# Altium project PCB_Project1.PrjPCB
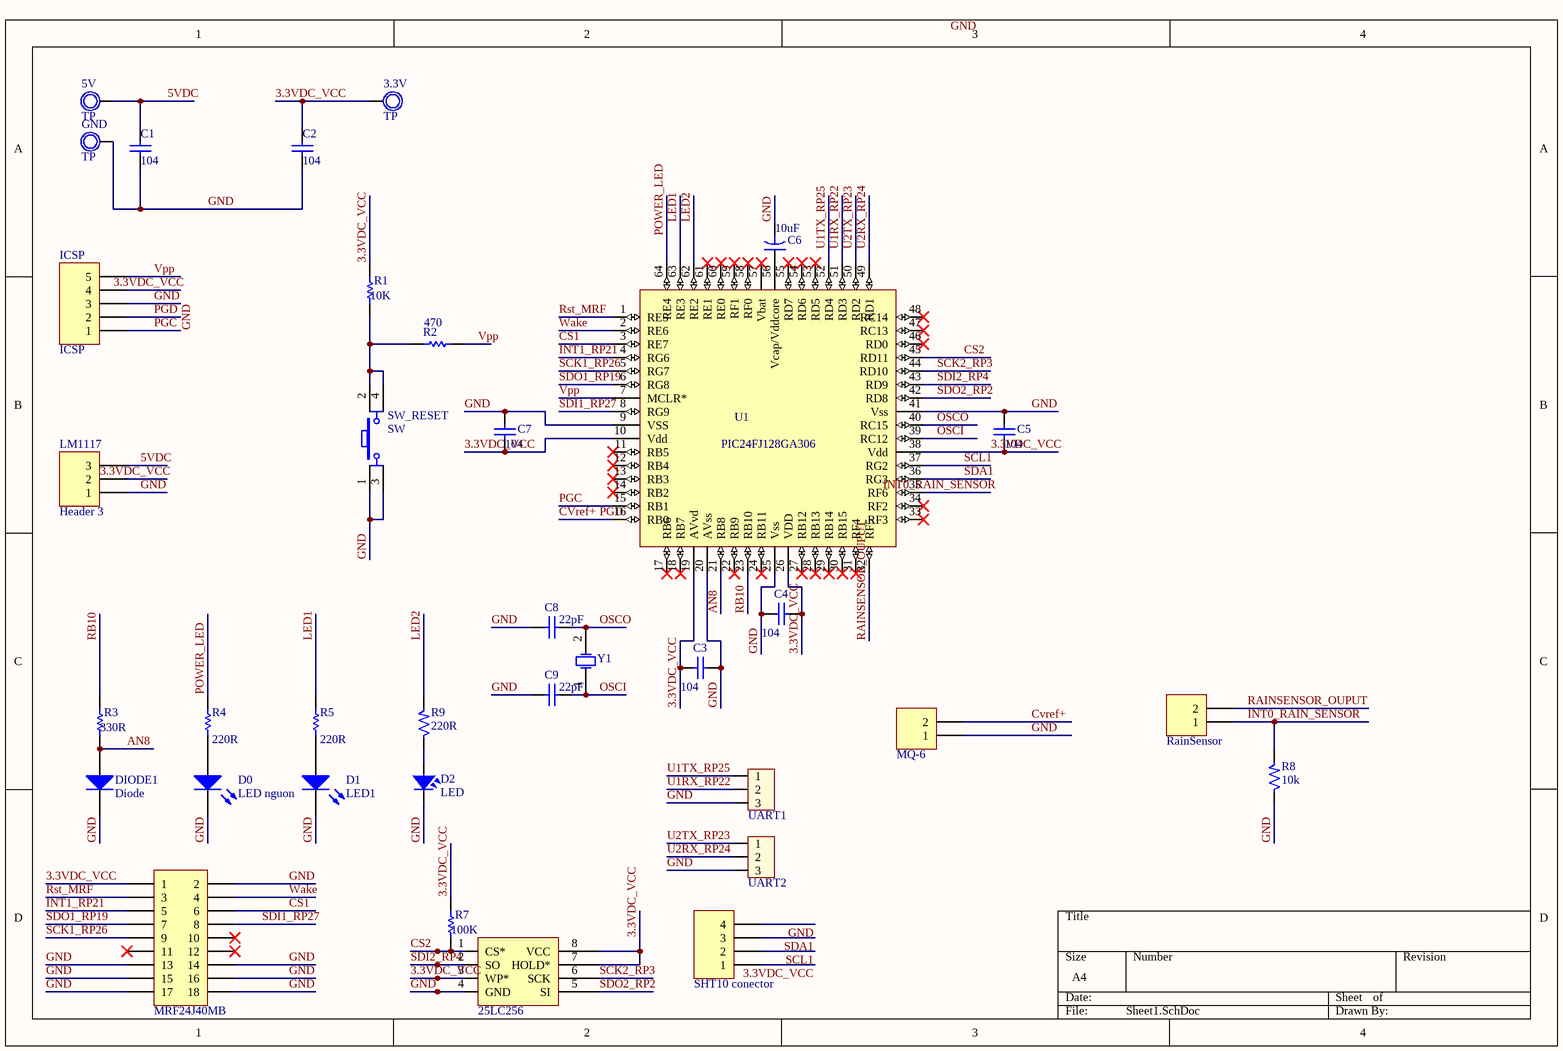
[diagram p0: Sheet1.SchDoc]
1 sheet, 36 parts. Net scope: global (net labels, ports and power ports of the same name join across sheets).
Board file: PCB1.PcbDoc

## Sheet Sheet1.SchDoc: SensorNodevsZigbee
size A4; Author: Hoang Anh Son BKHN; PageSetup: Record=PageOptions|CenterHorizontal=True|CenterVertical=True|PrintScale=1.00|XCorrection=1.00|YCorrection=1.00|PrintKind=0|BorderSize=5000000|LeftOffset=0|BottomOffset=0|Orientation=2|PaperLength=1000|PaperWidth=1000|Scale=100|PaperSource=7|PrintQuality=-4|MediaType=1|DitherType=10|PaperKind=Letter|PrintScaleMode=1

### Parts
3.3V  TP  [TP1]
5V  TP  [TP1]
25LC256  25LC256  [DIP-8]
C1  value 104  [C0805]  (hidden comment: Cap)
C2  value 104  [C0805]  (hidden comment: Cap)
C3  value 104  [C0805]  (hidden comment: Cap)
C4  value 104  [C0805]  (hidden comment: Cap)
C5  value 104  [C0805]  (hidden comment: Cap)
C6  value 10uF  [CAP P 6.3x5.4]  (hidden comment: Cap2)
C7  value 104  [C0805]  (hidden comment: Cap)
C8  value 22pF  [SM-0805]  (hidden comment: Cap)
C9  value 22pF  [SM-0805]  (hidden comment: Cap)
D0  LED nguon  [LED3mm]
D1  LED1  [LED3mm]
D2  LED  [LED3mm]
DIODE1  Diode  [DIODE/POW/1A]
GND  TP  [TP1]
ICSP  ICSP  [CON5]
LM1117  Header 3  [SOT223-4N]
MQ6  MQ-6  [CON2]
P?  MRF24J40MB  [MRF24J40MB_board - duplicate]
R1  value 10K  [C0805]  (hidden comment: Res1)
R2  value 470  [C0805]  (hidden comment: res)
R3  value 330R  [C0805]  (hidden comment: Res1)
R4  value 220R  [C0805]  (hidden comment: Res1)
R5  value 220R  [C0805]  (hidden comment: Res1)
R7  value 100K  [C0805]  (hidden comment: Res Semi)
R8  10k  [C0805]
R9  220R  [C0805]
RainSensor  RainSensor  [CON2]
SHT  SHT10 conector  [CON4]
SW_RESET  SW  [SW4]
U1  PIC24FJ128GA306  [TQFP-PT64_N]
UART1  UART1  [CON3]
UART2  UART2  [CON3]
Y1  XTAL  [XT2]  (value not drawn)

### Nets
3.3VDC_VCC: 3.3V.1 25LC256.3(WP*) 25LC256.7(HOLD*) 25LC256.8(VCC) C2.2 C3.1 C4.2 C5.1 C7.1 P?.1 R1.2 R7.2 SHT.1 U1.10(Vdd) U1.19(AVvd) U1.26(VDD) U1.38(Vdd)
5VDC: 5V.1 C1.2 LM1117.3
AN8: DIODE1.1(A) R3.1 U1.21(RB8)
CS1: P?.6 U1.3(RE7)
CS2: 25LC256.1(CS*) R7.1 U1.45(RD11)
CVref+: ICSP.2 MQ6.2 U1.16(RB0)  [also labelled PGD]
GND: 25LC256.4(GND) C1.1 C2.1 C3.2 C4.1 C5.2 C6.2 C7.2 C8.1 C9.1 D0.2(K) D1.2(K) D2.2 DIODE1.2(K) GND.1 ICSP.3 LM1117.1 MQ6.1 P?.2 P?.13 P?.14 P?.15 P?.16 P?.17 P?.18 R8.1 SHT.4 SW_RESET.1 SW_RESET.3 U1.9(VSS) U1.20(AVss) U1.25(Vss) U1.41(Vss) UART1.3 UART2.3
INT0_RAIN_SENSOR: R8.2 RainSensor.1
INT1_RP21: P?.5 U1.4(RG6)
LED1: R5.2 U1.63(RE3)
LED2: R9.2 U1.62(RE2)
OSCI: C9.2 U1.39(RC12) Y1.1(OSC1)
OSCO: C8.2 U1.40(RC15) Y1.2(OSC2)
PGC: ICSP.1 U1.15(RB1)
POWER_LED: R4.2 U1.64(RE4)
RAINSENSOR_OUPUT: RainSensor.2 U1.32(RF5)
RB10: R3.2 U1.23(RB10)
Rst_MRF: P?.3 U1.1(RE5)
SCK1_RP26: P?.9 U1.5(RG7)
SCK2_RP3: 25LC256.6(SCK) U1.44(RD10)
SCL1: SHT.2 U1.37(RG2)
SDA1: SHT.3 U1.36(RG3)
SDI1_RP27: P?.8 U1.8(RG9)
SDI2_RP4: 25LC256.2(SO) U1.43(RD9)
SDO1_RP19: P?.7 U1.6(RG8)
SDO2_RP2: 25LC256.5(SI) U1.42(RD8)
U1RX_RP22: U1.51(RD3) UART1.2
U1TX_RP25: U1.52(RD4) UART1.1
U2RX_RP24: U1.49(RD1) UART2.2
U2TX_RP23: U1.50(RD2) UART2.1
Vpp: ICSP.5 R2.2 U1.7(MCLR*)
Wake: P?.4 U1.2(RE6)
NetC6_1: C6.1 U1.56(Vcap/Vddcore)
NetD0_1: D0.1(A) R4.1
NetD1_1: D1.1(A) R5.1
NetD2_1: D2.1 R9.1
NetR1_1: R1.1 R2.1 SW_RESET.2 SW_RESET.4

Not connected (* = marked no-connect by the designer): ICSP 4; LM1117 2; P? 10* 11* 12*; U1 11(RB5)* 12(RB4)* 13(RB3)* 14(RB2)* 17(RB6)* 18(RB7)* 22(RB9)* 24(RB11)* 27(RB12)* 28(RB13)* 29(RB14)* 30(RB15)* 31(RF4)* 33(RF3)* 34(RF2)* 35(RF6) 46(RD0)* 47(RC13)* 48(RC14)* 53(RD5)* 54(RD6)* 55(RD7)* 57(Vbat)* 58(RF0)* 59(RF1)* 60(RE0)* 61(RE1)*

### Notes on the sheet
- Labels drawn without touching a wire or pin: 3.3VDC_VCC, GND, INT0_RAIN_SENSOR

### Library data of the parts
3.3V 5V GND = TP1: Test Point; Value: Test Point
C1-C5 C7-C9 = Cap: Capacitor; Published: 8-Jun-2000; LatestRevisionDate: 17-Jul-2002; LatestRevisionNote: Re-released for DXP Platform.; PackageReference: RAD-0.3; Publisher: Altium Limited; PackageDescription: Radial Cap, Thru-Hole; 2 Leads; 0.3 in Pin Spacing
C6 = Cap2: Capacitor; Published: 23-Sep-2002; PackageReference: CAPR5-4X5; Publisher: Altium Limited; PackageDescription: Capacitor; 2 Leads
D0 D1 = LED0: Typical INFRARED GaAs LED; Published: 8-Jun-2000; LatestRevisionDate: 08-Jul-2005; LatestRevisionNote: Mech Layer 1 removed.; PackageReference: LED-0; Publisher: Altium Limited; PackageDescription: LED; 2 Leads
D2 = LED: LED Single colour Green and Red; Value: LED 3 ly Single Colour; Description: LED 5 ly Single Colour; Description: Led  Vuong
DIODE1 = Diode: Default Diode; Published: 8-Jun-2000; LatestRevisionDate: 17-Jul-2002; LatestRevisionNote: Re-released for DXP Platform.; PackageVersion: Sep-1996; PackageReference: SMC; Publisher: Altium Limited; PackageDescription: DO-214-AB/SMC; 2 C-Bend Leads; Body 7.9 x 5.9 mm, inc. leads (LxW); Code_JEDEC: DO-214-AB
ICSP = Header 5: Header, 5-Pin; LatestRevisionDate: 17-Jul-2002; LatestRevisionNote: Re-released for DXP Platform.; Publisher: Altium Limited
LM1117 = Header 3: Header, 3-Pin; LatestRevisionDate: 17-Jul-2002; LatestRevisionNote: Re-released for DXP Platform.; Publisher: Altium Limited
MQ6 RainSensor = Header 2: Header, 2-Pin; LatestRevisionDate: 17-Jul-2002; LatestRevisionNote: Re-released for DXP Platform.; Publisher: Altium Limited
P? = Header 9X2: Header, 9-Pin, Dual row; LatestRevisionDate: 17-Jul-2002; LatestRevisionNote: Re-released for DXP Platform.; Publisher: Altium Limited
R1-R5 = Res1: Resistor; Published: 8-Jun-2000; LatestRevisionDate: 17-Jul-2002; LatestRevisionNote: Re-released for DXP Platform.; PackageReference: AXIAL-0.3; Publisher: Altium Limited; PackageDescription: Axial Device, Thru-Hole; 2 Leads; 0.3 in Pin Spacing
R7 = Res Semi: Semiconductor Resistor; Published: 8-Jun-2000; LatestRevisionDate: 17-Jul-2002; LatestRevisionNote: Re-released for DXP Platform.; PackageReference: AXIAL-0.5; Publisher: Altium Limited; PackageDescription: Axial Device, Thru-Hole; 2 Leads; 0.5 in Pin Spacing
R8 R9 = R: Resistor 1/4W; Value: R1/4W - 1K
SHT = Header 4: Header, 4-Pin; LatestRevisionDate: 17-Jul-2002; LatestRevisionNote: Re-released for DXP Platform.; Publisher: Altium Limited
SW_RESET = SW4: Switch button 4 pin; Value: Button chip 4 pin
UART1 UART2 = Con3: Connector 3; Value: Connector 3
Y1 = XTAL: Crystal Oscillator; Published: 8-Jun-2000; LatestRevisionDate: 17-Jul-2002; LatestRevisionNote: Re-released for DXP Platform.; PackageReference: R38; Publisher: Altium Limited; PackageDescription: Crystal, Thru-Hole; 2 Leads; Body 3.1 x 8.2 mm (Dia.xH)